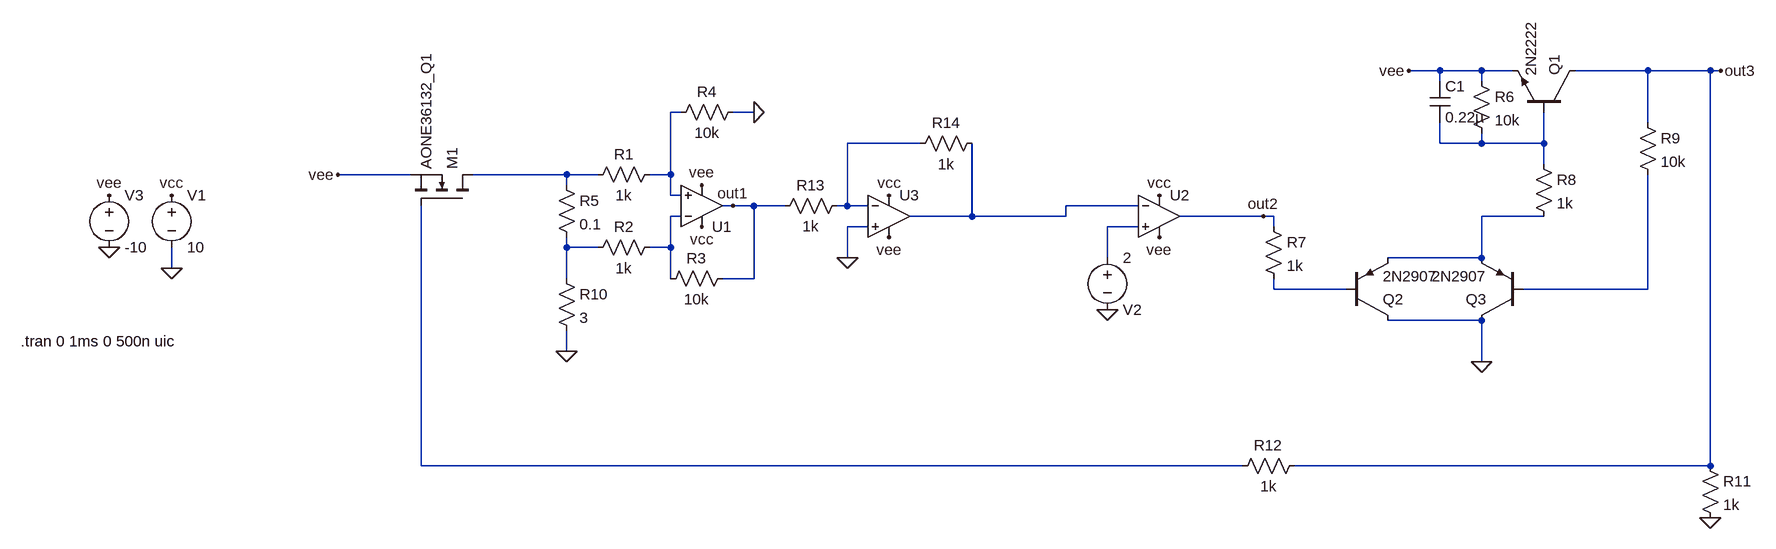
[diagram p0: schematic Negative_rail_current_limit_with_latch.asc]
Negative_rail_current_limit_with_latch.asc, the LTspice schematic file:
Version 4
SHEET 1 1816 948
WIRE 1248 -48 1200 -48
WIRE 1312 -48 1248 -48
WIRE 1360 -48 1312 -48
WIRE 1568 -48 1456 -48
WIRE 1664 -48 1568 -48
WIRE 1680 -48 1664 -48
WIRE 1248 -32 1248 -48
WIRE 1312 -32 1312 -48
WIRE 80 16 64 16
WIRE 192 16 160 16
WIRE 1568 32 1568 -48
WIRE 448 64 336 64
WIRE 1248 64 1248 32
WIRE 1312 64 1312 48
WIRE 1312 64 1248 64
WIRE 1408 64 1408 16
WIRE 1408 64 1312 64
WIRE 1408 96 1408 64
WIRE -336 112 -448 112
WIRE -96 112 -240 112
WIRE -48 112 -96 112
WIRE 64 112 64 16
WIRE 64 112 32 112
WIRE -96 128 -96 112
WIRE 64 144 64 112
WIRE 80 144 64 144
WIRE 160 160 144 160
WIRE 192 160 160 160
WIRE 240 160 192 160
WIRE 336 160 336 64
WIRE 336 160 320 160
WIRE 368 160 336 160
WIRE 784 160 672 160
WIRE 80 176 64 176
WIRE 528 176 528 64
WIRE 528 176 432 176
WIRE 672 176 672 160
WIRE 672 176 528 176
WIRE 976 176 848 176
WIRE 992 176 976 176
WIRE 1408 176 1312 176
WIRE 368 192 336 192
WIRE 784 192 736 192
WIRE 992 192 992 176
WIRE -96 224 -96 208
WIRE -48 224 -96 224
WIRE 64 224 64 176
WIRE 64 224 32 224
WIRE 336 240 336 192
WIRE 736 240 736 192
WIRE 1312 240 1312 176
WIRE 1312 240 1168 240
WIRE -704 256 -704 224
WIRE -96 272 -96 224
WIRE 64 272 64 224
WIRE 192 272 192 160
WIRE 192 272 144 272
WIRE 992 288 992 272
WIRE 1104 288 992 288
WIRE 1568 288 1568 112
WIRE 1568 288 1376 288
WIRE 1312 336 1168 336
WIRE -96 384 -96 352
WIRE 1312 400 1312 336
WIRE -320 560 -320 160
WIRE 944 560 -320 560
WIRE 1664 560 1664 -48
WIRE 1664 560 1024 560
FLAG -704 256 0
FLAG -704 144 vcc
FLAG -96 384 0
FLAG 736 320 0
FLAG 192 16 0
FLAG -800 144 vee
FLAG -800 224 0
FLAG 160 160 out1
FLAG 976 176 out2
FLAG 1312 400 0
FLAG 1680 -48 out3
FLAG -448 112 vee
FLAG 1200 -48 vee
FLAG 112 192 vcc
FLAG 816 144 vcc
FLAG 816 208 vee
FLAG 112 128 vee
FLAG 1664 640 0
FLAG 336 240 0
FLAG 400 208 vee
FLAG 400 144 vcc
SYMBOL res 48 208 R90
WINDOW 0 0 56 VBottom 2
WINDOW 3 32 56 VTop 2
SYMATTR InstName R2
SYMATTR Value 1k
SYMBOL res 48 96 R90
WINDOW 0 0 56 VBottom 2
WINDOW 3 32 56 VTop 2
SYMATTR InstName R1
SYMATTR Value 1k
SYMBOL res 160 256 R90
WINDOW 0 0 56 VBottom 2
WINDOW 3 32 56 VTop 2
SYMATTR InstName R3
SYMATTR Value 10k
SYMBOL res 176 0 R90
WINDOW 0 0 56 VBottom 2
WINDOW 3 32 56 VTop 2
SYMATTR InstName R4
SYMATTR Value 10k
SYMBOL voltage -704 128 R0
WINDOW 123 0 0 Left 0
WINDOW 39 0 0 Left 0
SYMATTR InstName V1
SYMATTR Value 10
SYMBOL res -112 112 R0
SYMATTR InstName R5
SYMATTR Value 0.1
SYMBOL voltage 736 224 R0
WINDOW 0 24 96 Left 2
WINDOW 3 24 16 Left 2
WINDOW 123 0 0 Left 0
WINDOW 39 0 0 Left 0
SYMATTR InstName V2
SYMATTR Value 2
SYMBOL voltage -800 128 R0
WINDOW 123 0 0 Left 0
WINDOW 39 0 0 Left 0
SYMATTR InstName V3
SYMATTR Value -10
SYMBOL OpAmps\\UniversalOpAmp2 816 176 R0
SYMATTR InstName U2
SYMBOL OpAmps\\UniversalOpAmp2 112 160 M180
SYMATTR InstName U1
SYMBOL res 1392 80 R0
SYMATTR InstName R8
SYMATTR Value 1k
SYMBOL res 1552 16 R0
SYMATTR InstName R9
SYMATTR Value 10k
SYMBOL res 976 176 R0
SYMATTR InstName R7
SYMATTR Value 1k
SYMBOL res 1296 -48 R0
SYMATTR InstName R6
SYMATTR Value 10k
SYMBOL pnp 1104 336 M180
SYMATTR InstName Q2
SYMATTR Value 2N2907
SYMBOL pnp 1376 336 R180
SYMATTR InstName Q3
SYMATTR Value 2N2907
SYMBOL npn 1456 16 M270
SYMATTR InstName Q1
SYMATTR Value 2N2222
SYMBOL nmos -240 160 M270
SYMATTR InstName M1
SYMATTR Value AONE36132_Q1
SYMBOL res -112 256 R0
SYMATTR InstName R10
SYMATTR Value 3
SYMBOL res 1648 544 R0
SYMATTR InstName R11
SYMATTR Value 1k
SYMBOL res 1040 544 R90
WINDOW 0 0 56 VBottom 2
WINDOW 3 32 56 VTop 2
SYMATTR InstName R12
SYMATTR Value 1k
SYMBOL cap 1232 -32 R0
SYMATTR InstName C1
SYMATTR Value 0.22µ
SYMBOL OpAmps\\UniversalOpAmp2 400 176 R0
SYMATTR InstName U3
SYMBOL res 336 144 R90
WINDOW 0 0 56 VBottom 2
WINDOW 3 32 56 VTop 2
SYMATTR InstName R13
SYMATTR Value 1k
SYMBOL res 544 48 R90
WINDOW 0 0 56 VBottom 2
WINDOW 3 32 56 VTop 2
SYMATTR InstName R14
SYMATTR Value 1k
TEXT -936 368 Left 2 !.tran 0 1ms 0 500n uic

The netlist it stands for:
* Negative_rail_current_limit_with_latch.asc
R2 N006 N009 1k
R1 N001 N004 1k
R3 out1 N006 10k
R4 0 N001 10k
V1 vcc 0 10
R5 N004 N009 0.1
V2 N008 0 2
V3 vee 0 -10
XU2 N008 N005 vcc vee out2 level2 Avol=1Meg GBW=10Meg Slew=10Meg Ilimit=25m Rail=0 Vos=0 En=0 Enk=0 In=0 Ink=0 Rin=500Meg  ; pins In+ In- V+ V- OUT
XU1 N001 N006 vcc vee out1 level2 Avol=1Meg GBW=10Meg Slew=10Meg Ilimit=25m Rail=0 Vos=0 En=0 Enk=0 In=0 Ink=0 Rin=500Meg  ; pins In+ In- V+ V- OUT
R8 N003 N007 1k
R9 out3 N011 10k
R7 out2 N010 1k
R6 vee N003 10k
Q2 0 N010 N007 0 2N2907
Q3 0 N011 N007 0 2N2907
Q1 out3 N003 vee 0 2N2222
M1 N004 N012 vee vee AONE36132_Q1
R10 N009 0 3
R11 out3 0 1k
R12 out3 N012 1k
C1 vee N003 0.22µ
XU3 0 N002 vcc vee N005 level2 Avol=1Meg GBW=10Meg Slew=10Meg Ilimit=25m Rail=0 Vos=0 En=0 Enk=0 In=0 Ink=0 Rin=500Meg  ; pins In+ In- V+ V- OUT
R13 N002 out1 1k
R14 N005 N002 1k
.model NPN NPN
.model PNP PNP
.lib standard.bjt
.model NMOS NMOS
.model PMOS PMOS
.lib standard.mos
.tran 0 1ms 0 500n uic
.lib UniversalOpAmp2.lib
.backanno
.end